# Altium schematic sheet USART.SchDoc
size A4; SheetNumber: 6; SheetTotal: 7
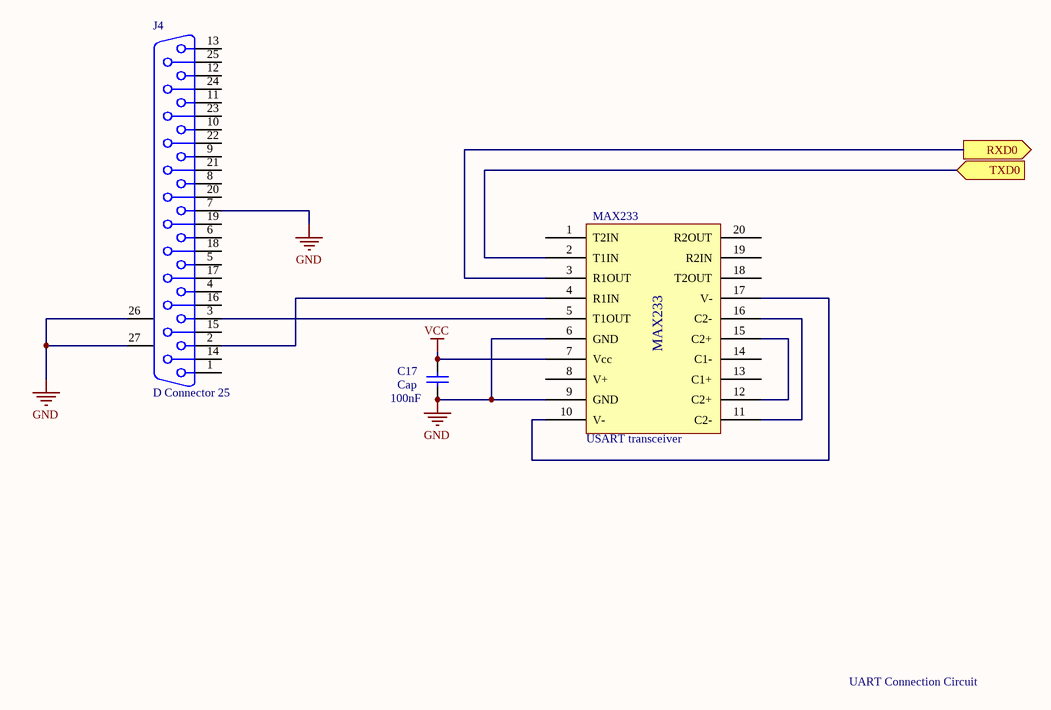
[diagram p0: USART.SchDoc]

## Parts
C17  Cap  value 100nF  [C1210]
J4  D Connector 25  [DSUB1.385-2H25A]
MAX233  USART transceiver  [MAX233 SOIC 20-PIN]

## Ports
RXD0 (out), TXD0 (in)

## Nets
GND: C17.2 J4.7 J4.26(MH1) J4.27(MH2) MAX233.6(GND) MAX233.9(GND)
VCC: C17.1 MAX233.7(Vcc)
RXD0: MAX233.3(R1OUT) ; port RXD0
TXD0: MAX233.2(T1IN) ; port TXD0
NetJ4_2: J4.2 MAX233.4(R1IN)
NetJ4_3: J4.3 MAX233.5(T1OUT)
NetMAX233_10: MAX233.10(V-) MAX233.17(V-)
NetMAX233_11: MAX233.11(C2-) MAX233.16(C2-)
NetMAX233_12: MAX233.12(C2+) MAX233.15(C2+)

Not connected (* = marked no-connect by the designer): J4 1 4 5 6 8 9 10 11 12 13 14 15 16 17 18 19 20 21 22 23 24 25; MAX233 1(T2IN) 8(V+) 13(C1+) 14(C1-) 18(T2OUT) 19(R2IN) 20(R2OUT)

## Notes on the sheet
- UART Connection Circuit
- Title:
- Course:
- TTK4155 Industrielle og innbygde datasystemers kontruksjon
- Size:
- Date:
- Author:
- A4
- Moltumyr, Andreas Hanssen
- Number:
- Time:
- Revision:
- Sheet
- of
- File:

## Library data of the parts
C17 = Cap Semi: Capacitor (Semiconductor SIM Model); Published: 8-Jun-2000; LatestRevisionDate: 29-May-2009; LatestRevisionNote: IPC-7351 Footprint Added.; PackageReference: C1206; Publisher: Altium Limited; PackageDescription: Chip Capacitor
J4 = D Connector 25: Receptacle Assembly, 25 Position, Right Angle; PackageDocument: U; Positions: 25; Published: 15-Jun-2001; LatestRevisionDate: 17-Jul-2002; LatestRevisionNote: Re-released for DXP Platform.; DatasheetDocument: 19-Mar-1999; PackageReference: 787202; Publisher: Altium Limited; Orientation: Right Angle; Gender: Receptacle
MAX233 = MAX233: Maxim RS232 transceiver